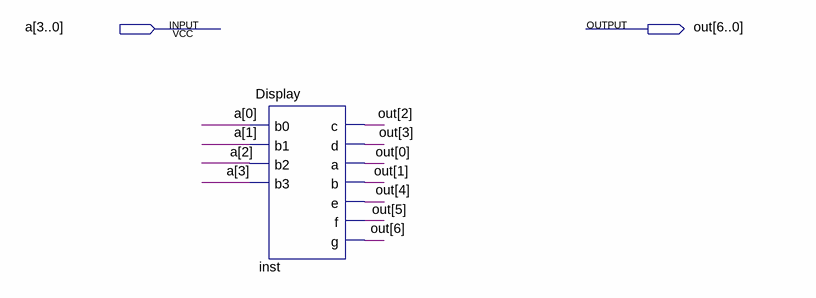
[diagram p0: schematic sheet]
// Quartus schematic ULA_display.bdf as structural Verilog: 1 symbols, 2 pins
module ULA_display (
  input  [3:0] a,
  output [6:0] out
);

  Display inst (
    .b0(a[0]), .b1(a[1]), .b2(a[2]), .b3(a[3]), .c(out[2]), .d(out[3]), .a(out[0]), .b(out[1]), .e(out[4]),
    .f(out[5]), .g(out[6]));
endmodule
